# Altium schematic sheet FiltroRF.SchDoc
size A4
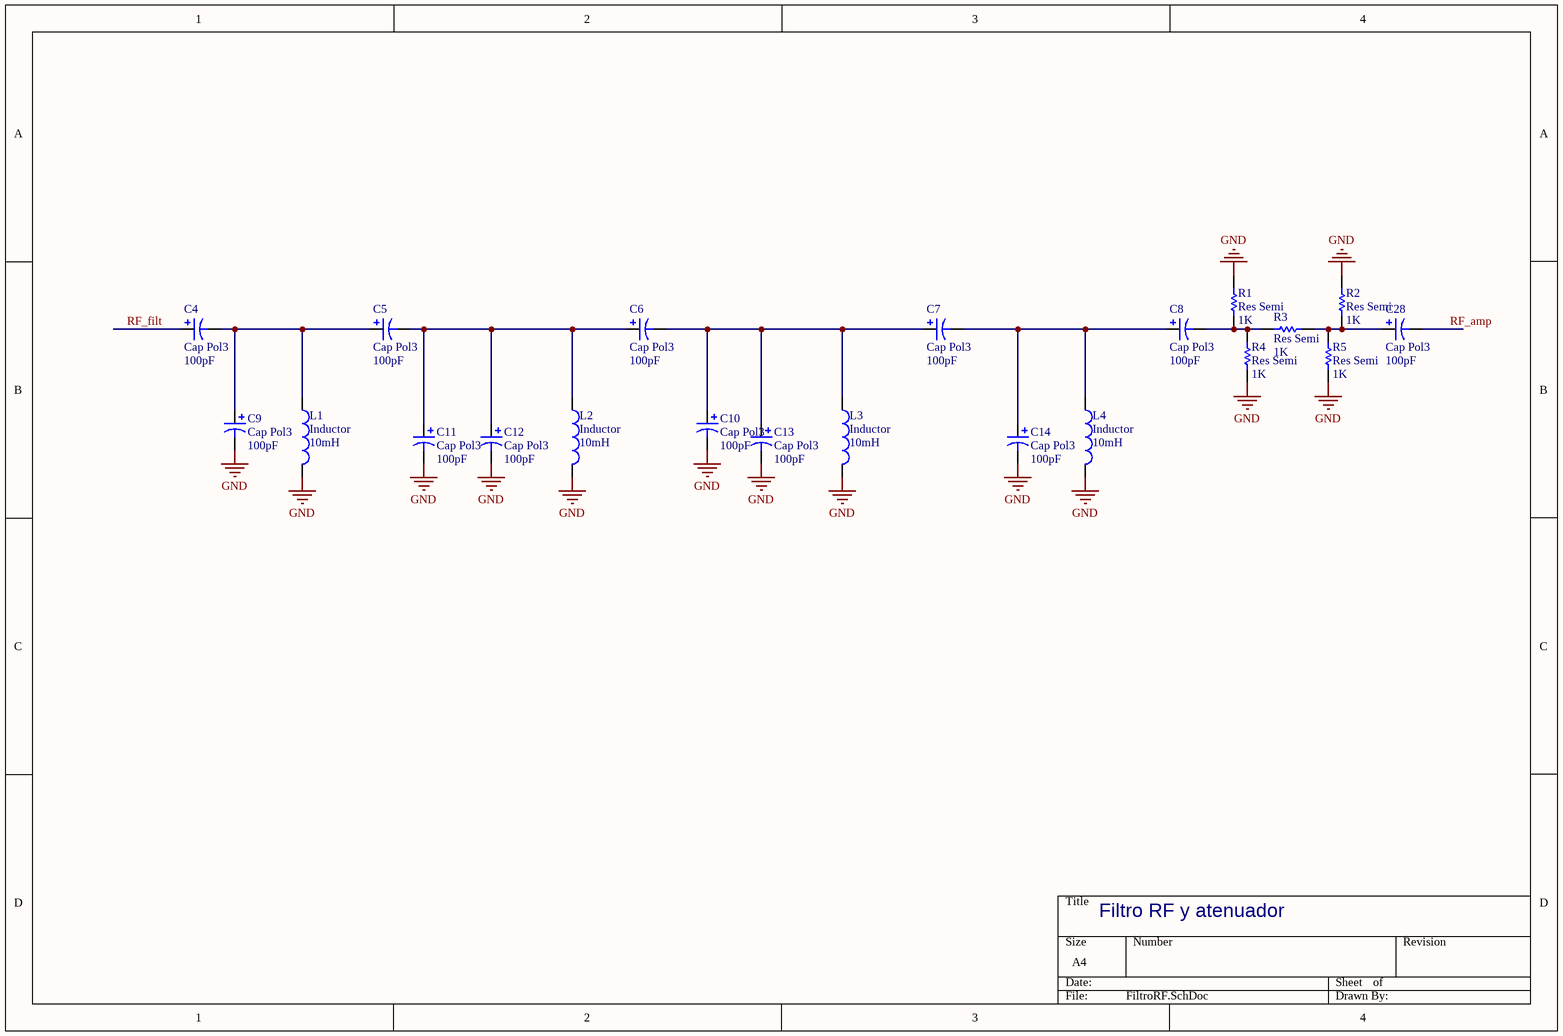
[diagram p0: FiltroRF.SchDoc]

## Parts
C4  Cap Pol3  value 100pF  [C0805]
C5  Cap Pol3  value 100pF  [C0805]
C6  Cap Pol3  value 100pF  [C0805]
C7  Cap Pol3  value 100pF  [C0805]
C8  Cap Pol3  value 100pF  [C0805]
C9  Cap Pol3  value 100pF  [C0805]
C10  Cap Pol3  value 100pF  [C0805]
C11  Cap Pol3  value 100pF  [C0805]
C12  Cap Pol3  value 100pF  [C0805]
C13  Cap Pol3  value 100pF  [C0805]
C14  Cap Pol3  value 100pF  [C0805]
C28  Cap Pol3  value 100pF  [C0805]
L1  Inductor  value 10mH  [3261]
L2  Inductor  value 10mH  [3261]
L3  Inductor  value 10mH  [3261]
L4  Inductor  value 10mH  [3261]
R1  Res Semi  value 1K  [2012[0805]]
R2  Res Semi  value 1K  [2012[0805]]
R3  Res Semi  value 1K  [2012[0805]]
R4  Res Semi  value 1K  [2012[0805]]
R5  Res Semi  value 1K  [2012[0805]]

## Nets
GND: C9.2 C10.2 C11.2 C12.2 C13.2 C14.2 L1.2 L2.2 L3.2 L4.2 R1.1 R2.1 R4.1 R5.1
RF_amp: C28.2
RF_filt: C4.1
NetC4_2: C4.2 C5.1 C9.1 L1.1
NetC5_2: C5.2 C6.1 C11.1 C12.1 L2.1
NetC6_2: C6.2 C7.1 C10.1 C13.1 L3.1
NetC7_2: C7.2 C8.1 C14.1 L4.1
NetC8_2: C8.2 R1.2 R3.2 R4.2
NetC28_1: C28.1 R2.2 R3.1 R5.2

## Notes on the sheet
- Filtro RF y atenuador

## Library data of the parts
C4-C14 C28 = Cap Pol3: Polarized Capacitor (Surface Mount); Published: 8-Jun-2000; LatestRevisionDate: 17-Jul-2002; LatestRevisionNote: Re-released for DXP Platform.; PackageReference: C0805; Publisher: Altium Limited
L1-L4 = Inductor: Code_IEC: 1005; Published: 8-Jun-2000; LatestRevisionDate: 17-Jul-2002; LatestRevisionNote: Re-released for DXP Platform.; PackageReference: 0402-A; Publisher: Altium Limited; Code_JEITA: 0402
R1-R5 = Res Semi: Semiconductor Resistor; Published: 8-Jun-2000; LatestRevisionDate: 17-Jul-2002; LatestRevisionNote: Re-released for DXP Platform.; PackageReference: AXIAL-0.5; Publisher: Altium Limited